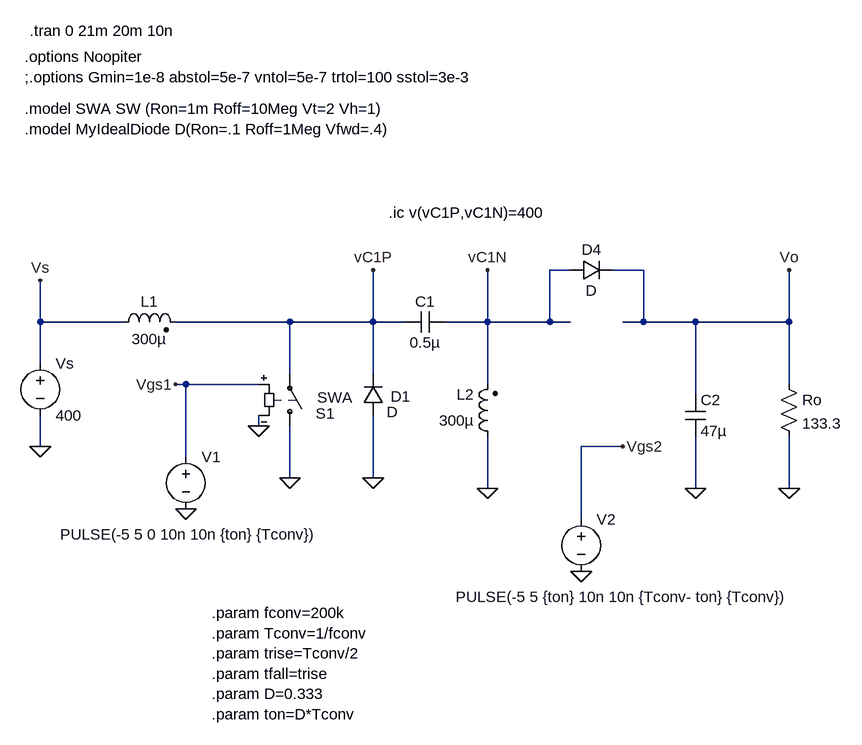
[diagram p0: schematic SEPIC.asc]
SEPIC.asc, the LTspice schematic file:
Version 4
SHEET 1 4440 3892
WIRE -240 448 -272 448
WIRE -128 448 -176 448
WIRE -1056 528 -1056 464
WIRE -928 528 -1056 528
WIRE -672 528 -848 528
WIRE -544 528 -544 448
WIRE -544 528 -672 528
WIRE -496 528 -544 528
WIRE -368 528 -368 448
WIRE -368 528 -432 528
WIRE -272 528 -272 448
WIRE -272 528 -368 528
WIRE -240 528 -272 528
WIRE -128 528 -128 448
WIRE -128 528 -160 528
WIRE -48 528 -128 528
WIRE 96 528 96 448
WIRE 96 528 -48 528
WIRE -1056 592 -1056 528
WIRE -672 608 -672 528
WIRE -544 608 -544 528
WIRE -832 624 -848 624
WIRE -720 624 -832 624
WIRE -368 624 -368 528
WIRE 96 624 96 528
WIRE -48 640 -48 528
WIRE -720 688 -720 672
WIRE -1056 720 -1056 672
WIRE -160 720 -224 720
WIRE -832 736 -832 624
WIRE -672 768 -672 688
WIRE -544 768 -544 672
WIRE -368 784 -368 704
WIRE -48 784 -48 704
WIRE 96 784 96 704
WIRE -224 832 -224 720
FLAG -1056 720 0
FLAG -720 688 0
FLAG -672 768 0
FLAG -48 784 0
FLAG 96 784 0
FLAG -1056 464 Vs
FLAG -848 624 Vgs1
FLAG 96 448 Vo
FLAG -832 816 0
FLAG -544 768 0
FLAG -368 784 0
FLAG -224 912 0
FLAG -160 720 Vgs2
FLAG -544 448 vC1P
FLAG -368 448 vC1N
SYMBOL voltage -1056 576 R0
WINDOW 123 0 0 Left 2
WINDOW 39 0 0 Left 2
SYMATTR InstName Vs
SYMATTR Value 400
SYMBOL ind2 -944 544 R270
WINDOW 0 32 56 VTop 2
WINDOW 3 5 56 VBottom 2
SYMATTR InstName L1
SYMATTR Value 300µ
SYMATTR Type ind
SYMBOL sw -672 704 M180
WINDOW 0 40 35 Left 2
WINDOW 3 42 60 Left 2
SYMATTR InstName S1
SYMATTR Value SWA
SYMBOL cap -64 640 R0
SYMATTR InstName C2
SYMATTR Value 47µ
SYMBOL res 80 608 R0
SYMATTR InstName Ro
SYMATTR Value 133.3
SYMBOL voltage -832 720 R0
WINDOW 123 0 0 Left 2
WINDOW 39 0 0 Left 2
WINDOW 3 -193 135 Left 2
SYMATTR Value PULSE(-5 5 0 10n 10n {ton} {Tconv})
SYMATTR InstName V1
SYMBOL diode -528 672 R180
WINDOW 0 -42 29 Left 2
WINDOW 3 -22 5 Left 2
SYMATTR InstName D1
SYMBOL cap -432 512 R90
WINDOW 0 0 32 VBottom 2
WINDOW 3 32 32 VTop 2
SYMATTR InstName C1
SYMATTR Value 0.5µ
SYMBOL diode -240 464 R270
WINDOW 0 32 32 VTop 2
WINDOW 3 0 32 VBottom 2
SYMATTR InstName D4
SYMBOL voltage -224 816 R0
WINDOW 123 0 0 Left 2
WINDOW 39 0 0 Left 2
WINDOW 3 -193 135 Left 2
SYMATTR Value PULSE(-5 5 {ton} 10n 10n {Tconv- ton} {Tconv})
SYMATTR InstName V2
SYMBOL ind2 -352 720 R180
WINDOW 0 36 80 Left 2
WINDOW 3 36 40 Left 2
SYMATTR InstName L2
SYMATTR Value 300µ
SYMATTR Type ind
TEXT -792 976 Left 2 !.param fconv=200k \n.param Tconv=1/fconv\n.param trise=Tconv/2\n.param tfall=trise\n.param D=0.333\n.param ton=D*Tconv
TEXT -1080 120 Left 2 !.options Noopiter\n;.options Gmin=1e-8 abstol=5e-7 vntol=5e-7 trtol=100 sstol=3e-3
TEXT -1072 80 Left 2 !.tran 0 21m 20m 10n
TEXT -1080 200 Left 2 !.model SWA SW (Ron=1m Roff=10Meg Vt=2 Vh=1)\n.model MyIdealDiode D(Ron=.1 Roff=1Meg Vfwd=.4)
TEXT -520 360 Left 2 !.ic v(vC1P,vC1N)=400

The netlist it stands for:
* SEPIC.asc
Vs Vs 0 400
L1 Vs vC1P 300µ
S1 0 vC1P Vgs1 0 SWA
C2 Vo 0 47µ
Ro Vo 0 133.3
V1 Vgs1 0 PULSE(-5 5 0 10n 10n {ton} {Tconv})
D1 0 vC1P D
C1 vC1N vC1P 0.5µ
D4 vC1N Vo D
V2 Vgs2 0 PULSE(-5 5 {ton} 10n 10n {Tconv- ton} {Tconv})
L2 0 vC1N 300µ
.model D D
.lib standard.dio
.param fconv=200k
.param Tconv=1/fconv
.param trise=Tconv/2
.param tfall=trise
.param D=0.333
.param ton=D*Tconv
.options Noopiter
;.options Gmin=1e-8 abstol=5e-7 vntol=5e-7 trtol=100 sstol=3e-3
.tran 0 21m 20m 10n
.model SWA SW (Ron=1m Roff=10Meg Vt=2 Vh=1)
.model MyIdealDiode D(Ron=.1 Roff=1Meg Vfwd=.4)
.ic v(vC1P,vC1N)=400
.backanno
.end